# EAGLE design newbrd2 (EAGLE 7.6.0)
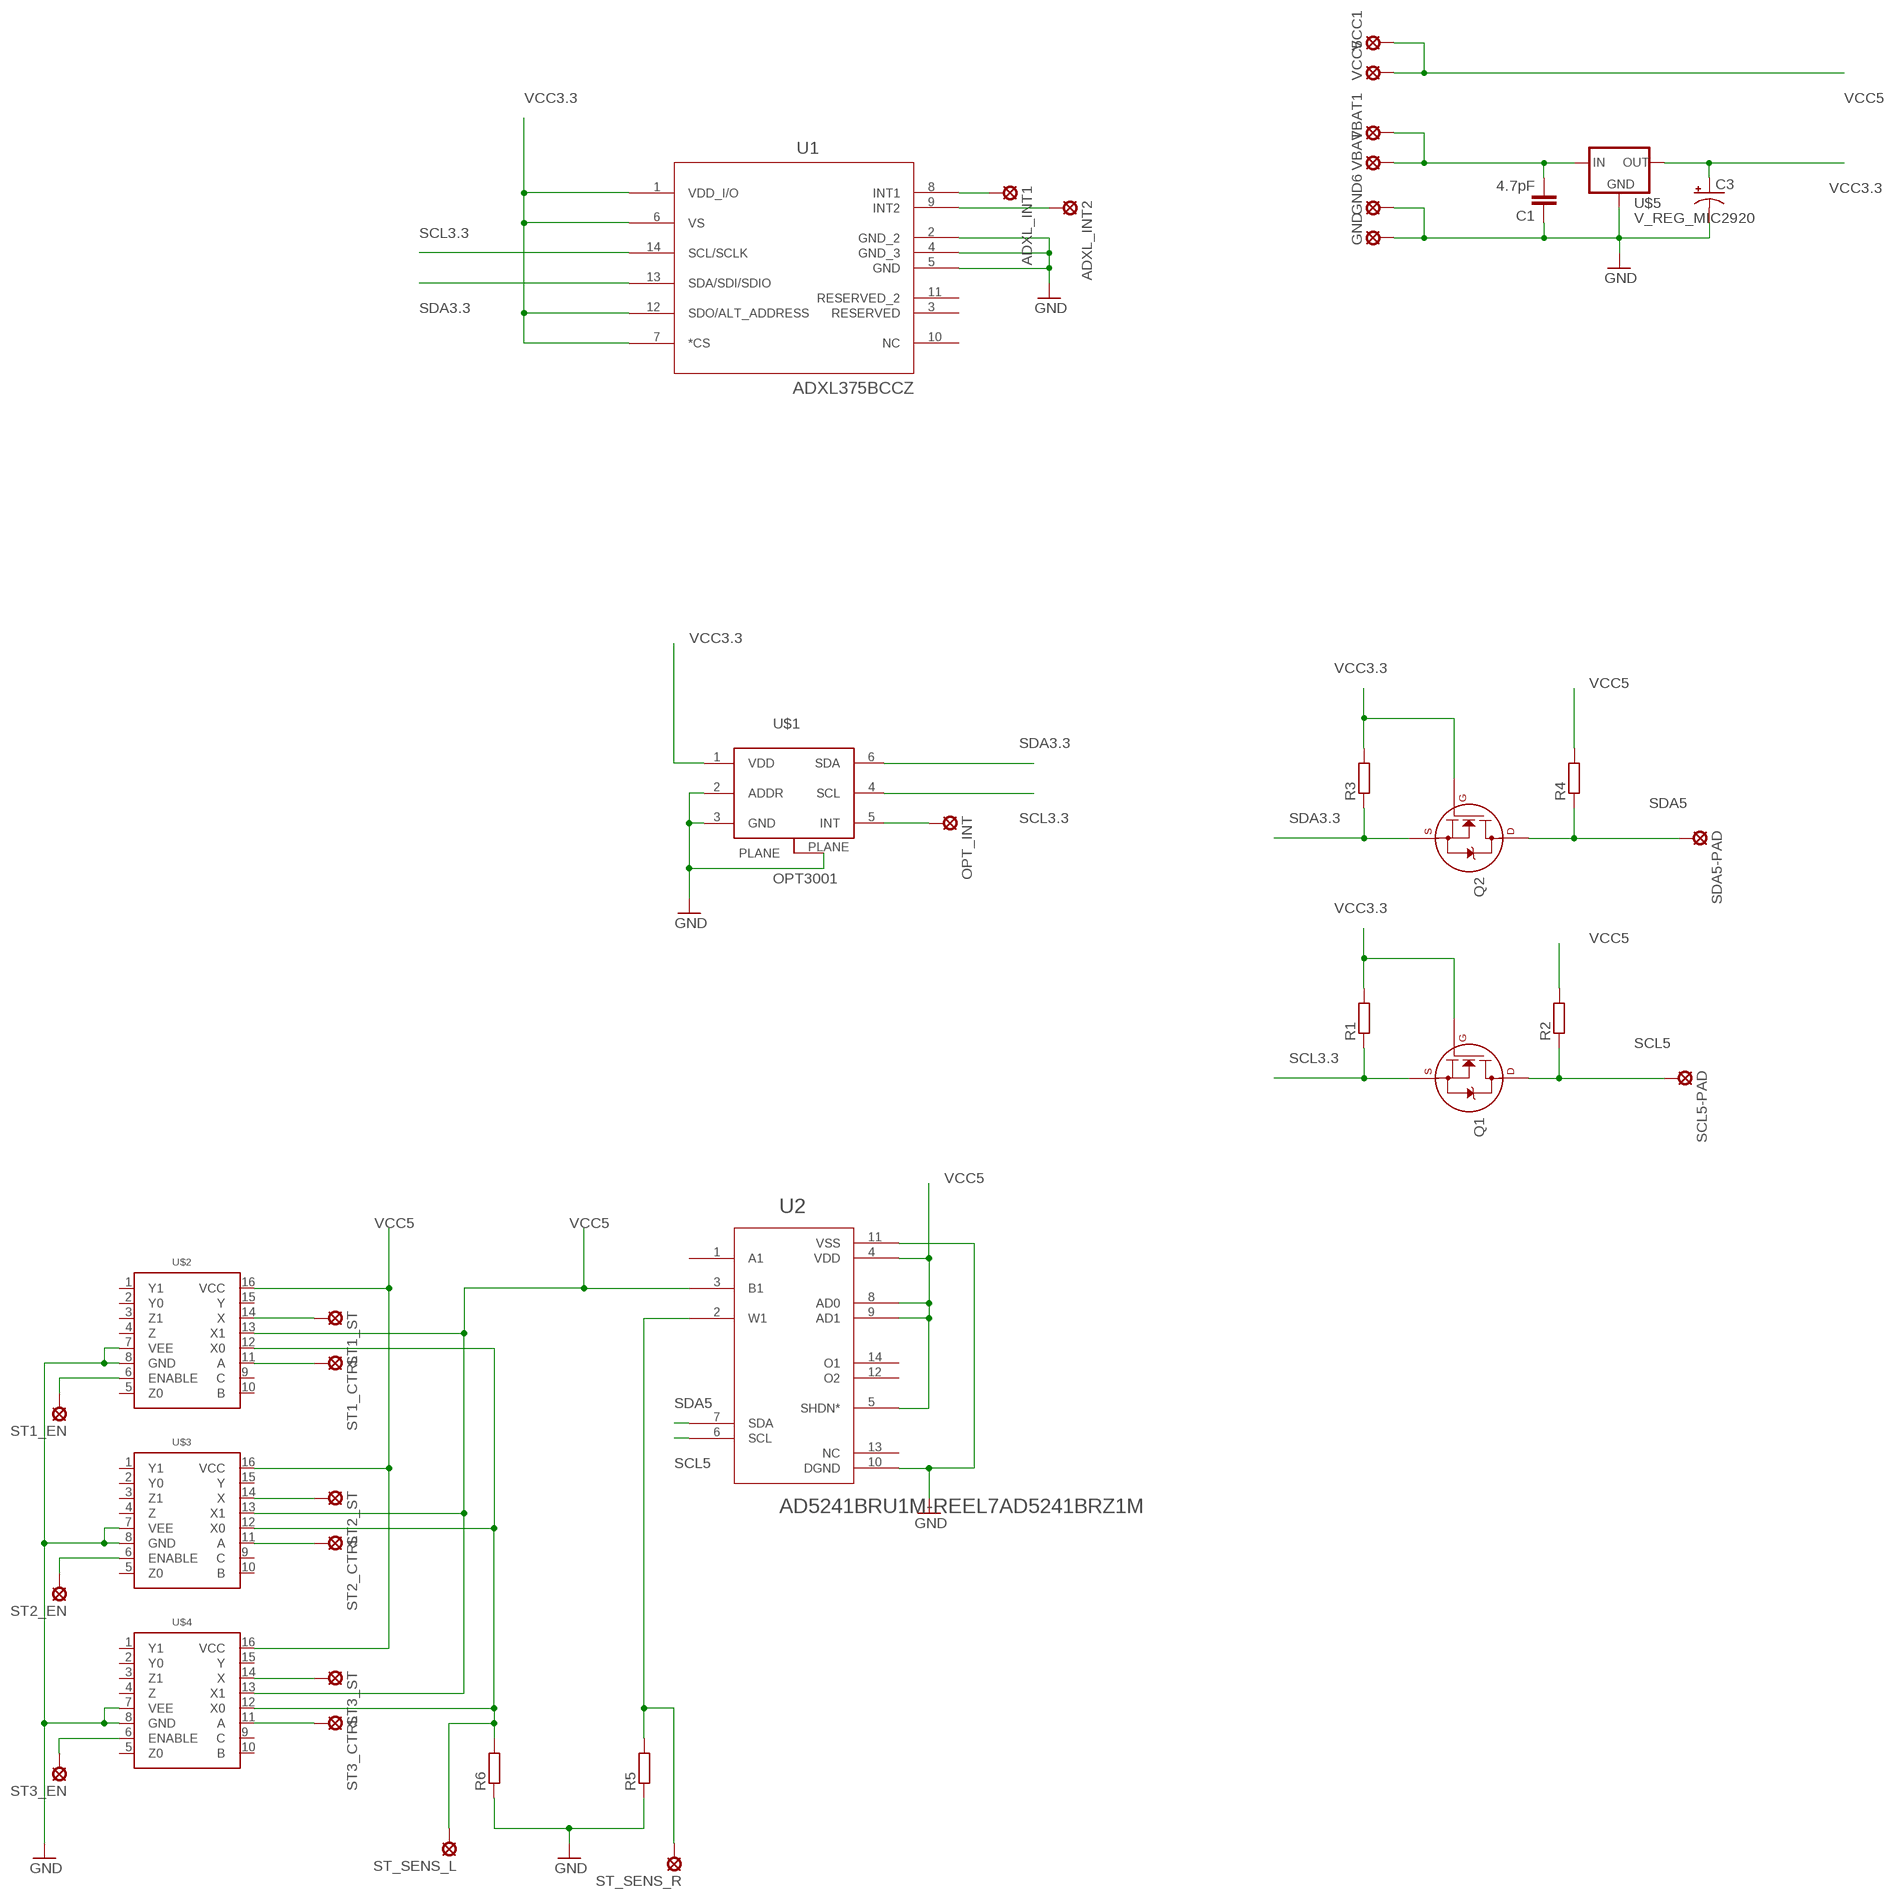
[diagram p0: schematic, sheet 1]

## Parts
ADXL_INT1  LSP10  [LSP10]
ADXL_INT2  LSP10  [LSP10]
C1  4.7pF  C-EUC0603  [C0603]
C3  CAP_POL3528  [EIA3528]
GND  LSP10  [LSP10]
GND6  LSP10  [LSP10]
OPT_INT  LSP10  [LSP10]
Q1  2N7002_SOT23  [SOT-23]
Q2  2N7002_SOT23  [SOT-23]
R1  R-EU_R0805  [R0805]
R2  R-EU_R0805  [R0805]
R3  R-EU_R0805  [R0805]
R4  R-EU_R0805  [R0805]
R5  R-EU_R0805  [R0805]
R6  R-EU_R0805  [R0805]
SCL5-PAD  LSP10  [LSP10]
SDA5-PAD  LSP10  [LSP10]
ST1_CTRL  LSP10  [LSP10]
ST1_EN  LSP10  [LSP10]
ST1_ST  LSP10  [LSP10]
ST2_CTRL  LSP10  [LSP10]
ST2_EN  LSP10  [LSP10]
ST2_ST  LSP10  [LSP10]
ST3_CTRL  LSP10  [LSP10]
ST3_EN  LSP10  [LSP10]
ST3_ST  LSP10  [LSP10]
ST_SENS_L  LSP10  [LSP10]
ST_SENS_R  LSP10  [LSP10]
U1  ADXL375BCCZ  [LGA_CC-14-1]
U2  AD5241BRU1M-REEL7AD5241BRZ1M  [SOIC-14]
U$1  OPT3001  [OPT3001]
U$2  MC74HC4051AMC74HC4051AG  [SOIC-16]
U$3  MC74HC4051AMC74HC4051AG  [SOIC-16]
U$4  MC74HC4051AMC74HC4051AG  [SOIC-16]
U$5  V_REG_MIC2920  [SOT223]
VBAT  LSP10  [LSP10]
VBAT1  LSP10  [LSP10]
VCC1  LSP10  [LSP10]
VCC5  LSP10  [LSP10]

## Nets
GND: C1.1 C3.C(-) GND6.MP GND.MP R5.1 R6.1 U1.2(GND_2) U1.4(GND_3) U1.5(GND) U2.10(DGND) U2.11(VSS) U$1.2(ADDR) U$1.3(GND) U$1.PLANE U$2.7(VEE) U$2.8(GND) U$3.7(VEE) U$3.8(GND) U$4.7(VEE) U$4.8(GND) U$5.2(GND)
N$1: C1.2 U$5.1(IN) VBAT1.MP VBAT.MP
N$2: ST1_ST.MP U$2.14(X)
N$3: ST1_EN.MP U$2.6(ENABLE)
N$4: ST3_EN.MP U$4.6(ENABLE)
N$5: ST2_ST.MP U$3.14(X)
N$6: ST3_ST.MP U$4.14(X)
N$8: R5.2 ST_SENS_R.MP U2.2(W1)
N$9: R6.2 ST_SENS_L.MP U$2.12(X0) U$3.12(X0) U$4.12(X0)
N$11: ST2_EN.MP U$3.6(ENABLE)
N$12: ST2_CTRL.MP U$3.11(A)
N$13: ST3_CTRL.MP U$4.11(A)
N$14: ST1_CTRL.MP U$2.11(A)
N$15: OPT_INT.MP U$1.5(INT)
N$16: ADXL_INT1.MP U1.8(INT1)
N$17: ADXL_INT2.MP U1.9(INT2)
SCL3.3: Q1.2(S) R1.1 U1.14(SCL/SCLK) U$1.4(SCL)
SCL5: Q1.3(D) R2.1 SCL5-PAD.MP U2.6(SCL)
SDA3.3: Q2.2(S) R3.1 U1.13(SDA/SDI/SDIO) U$1.6(SDA)
SDA5: Q2.3(D) R4.1 SDA5-PAD.MP U2.7(SDA)
VCC3.3: C3.A(+) Q1.1(G) Q2.1(G) R1.2 R3.2 U1.1(VDD_I/O) U1.6(VS) U1.7(*CS) U1.12(SDO/ALT_ADDRESS) U$1.1(VDD) U$5.3(OUT)
VCC5: R2.2 R4.2 U2.3(B1) U2.4(VDD) U2.5(SHDN*) U2.8(AD0) U2.9(AD1) U$2.13(X1) U$2.16(VCC) U$3.13(X1) U$3.16(VCC) U$4.13(X1) U$4.16(VCC) VCC1.MP VCC5.MP
Unconnected: U1.3(RESERVED) U1.10(NC) U1.11(RESERVED_2) U2.1(A1) U2.12(O2) U2.13(NC) U2.14(O1) U$2.1(Y1) U$2.2(Y0) U$2.3(Z1) U$2.4(Z) U$2.5(Z0) U$2.9(C) U$2.10(B) U$2.15(Y) U$3.1(Y1) U$3.2(Y0) U$3.3(Z1) U$3.4(Z) U$3.5(Z0) U$3.9(C) U$3.10(B) U$3.15(Y) U$4.1(Y1) U$4.2(Y0) U$4.3(Z1) U$4.4(Z) U$4.5(Z0) U$4.9(C) U$4.10(B) U$4.15(Y)

## Library data of the parts
ADXL_INT1 ADXL_INT2 GND GND6 OPT_INT SCL5-PAD SDA5-PAD ST1_CTRL ST1_EN ST1_ST ST2_CTRL ST2_EN ST2_ST ST3_CTRL ST3_EN ST3_ST ST_SENS_L ST_SENS_R VBAT VBAT1 VCC1 VCC5 = solpad:LSP10: SOLDER PAD drill 1.0 mm, distributor Buerklin, 12H555
C1 = rcl:C-EU: CAPACITOR, European symbol
C3 = SparkFun-Capacitors:CAP_POL: Capacitor Polarized These are standard SMD and PTH capacitors. Normally 10uF, 47uF, and 100uF in electrolytic and tantalum varieties. Always verify the external diameter of the through hole cap, it varies with capacity, voltage, and manufacturer. The EIA devices should be standard.
Q1 Q2 = transistors:2N700*: 2N7000, 2N7002, NDS7002A N-channel enhancement mode MOSFET
R1-R6 = resistor:R-EU_: RESISTOR, European symbol
U1 = elements:ADXL375BCCZ
U2 = elements:AD5241BRU1M-REEL7
U$1 = datchiki:OPT3001
U$2-U$4 = elements:MC74HC4051A
U$5 = SparkFun-PowerIC:V_REG_MIC2920: MIC2920A (http://www.micrel.com/_PDF/mic2920.pdf) - 400mA output LDO Regulator

## Board
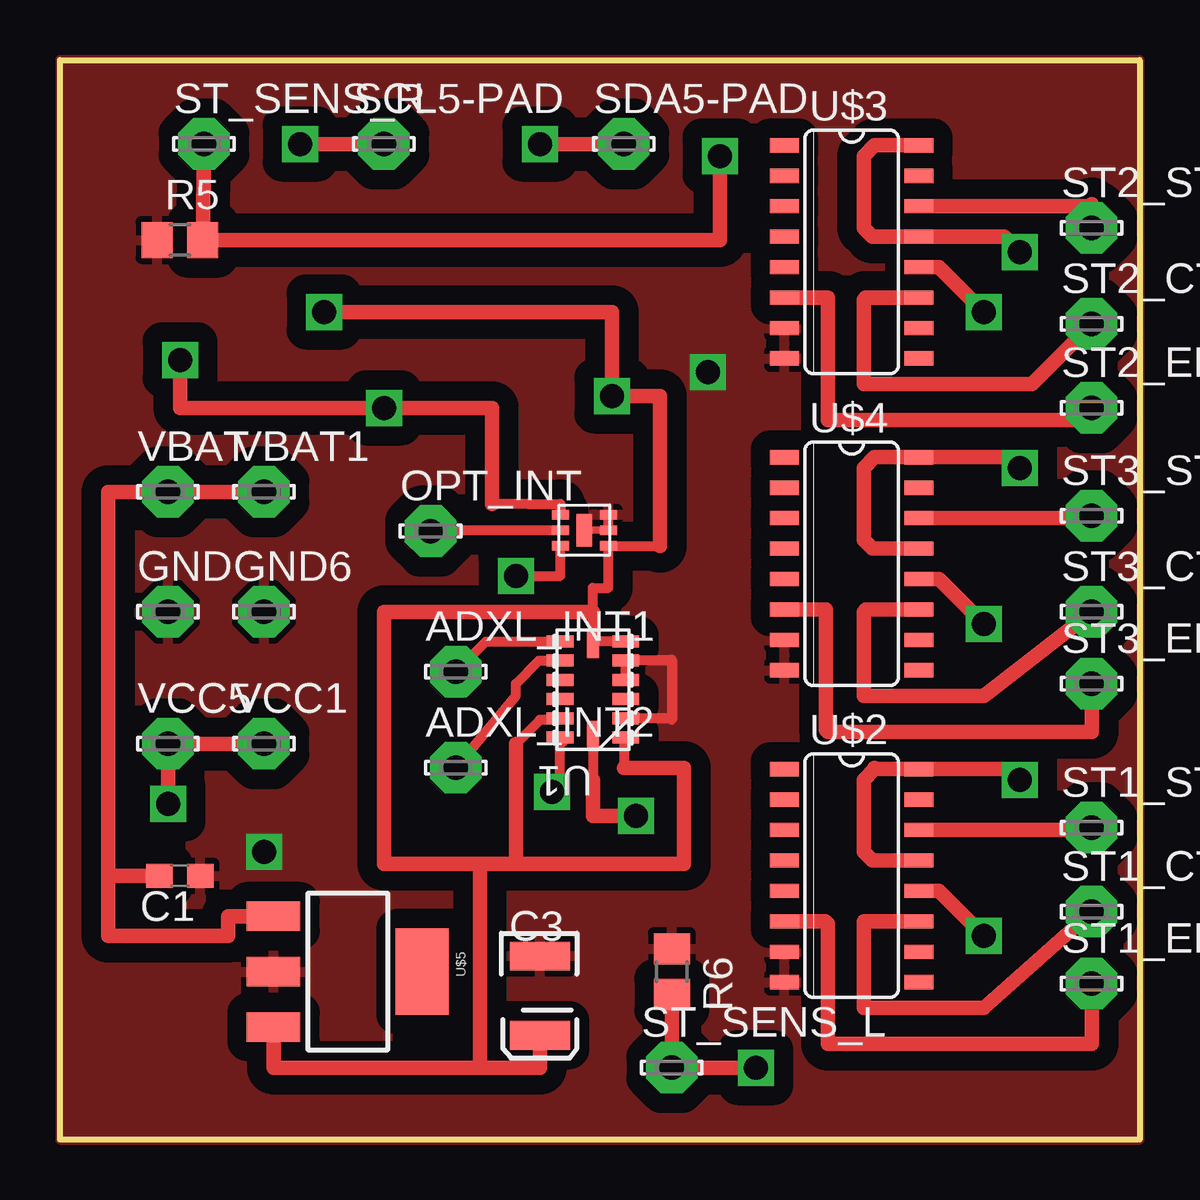
[diagram p1: board, top side]
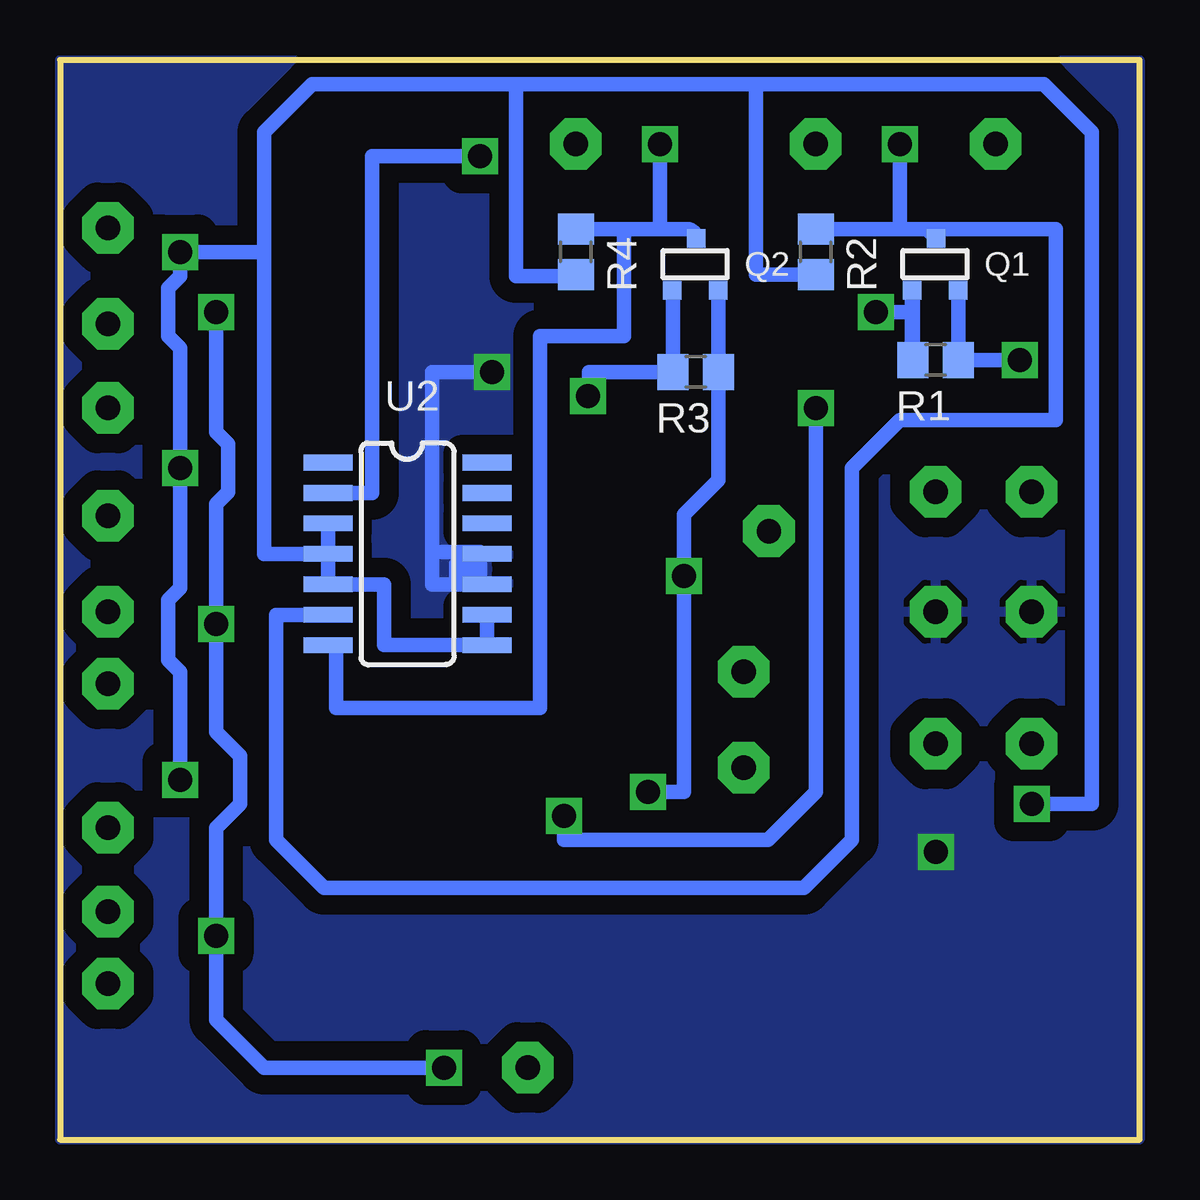
[diagram p2: board, bottom side, seen from below]

Size 45 x 45 mm. Coordinates in mm from the lower left corner, seen from the top.
Outline: 0,0 0,45 45,45 45,0 0,0
Copper layers (1*16): Top 0.035mm / dielectric 1.5mm / Bottom 0.035mm
Design rules "default *": minimum track width 10mil, minimum drill 1mm, track to track 8mil, track to pad 8mil, pad to pad 8mil, via to via 8mil, smd to smd 8mil, copper to edge 0mil, drill to drill 8mil, minimum pad ring 10mil, minimum via ring 8mil, stop-mask expansion 4mil, vias tented up to drill 0mil, thermal gap 10mil

### Footprints (pad centres in the part's own frame; a part is rotated, then mirrored left to right if it is on the bottom)
LSP10 = drill 1.016 pad 2.159 octagon: MP 0,0
C0603 = smd 1.1 x 1: 1 -0.85,0; 2 0.85,0
EIA3528 = smd 1.2 x 2.5: A 1.65,0; C -1.65,0
SOT-23 = smd 0.762 x 0.762: 1 -0.979,-1.101; 2 0.94,-1.101; 3 0.025,1.067
R0805 = smd 1.3 x 1.5: 1 -0.95,0; 2 0.95,0
LGA_CC-14-1 = smd 1.118 x 0.5: 1 -1.371,2; 2 -1.371,1.2; 3 -1.371,0.4; 4 -1.371,-0.4; 5 -1.371,-1.2; 6 -1.371,-2; 8 1.371,-2; 9 1.371,-1.2; 10 1.371,-0.4; 11 1.371,0.4; 12 1.371,1.2; 13 1.371,2 | smd 0.5 x 1.118: 7 0,-1.871; 14 0,1.871
SOIC-14 = smd 0.66 x 2.032: 1 -4.445,-3.315; 2 -3.175,-3.315; 3 -1.905,-3.315; 4 -0.635,-3.315; 5 0.635,-3.315; 6 1.905,-3.315; 7 3.175,-3.315; 8 3.175,3.315; 9 1.905,3.315; 10 0.635,3.315; 11 -0.635,3.315; 12 -1.905,3.315; 13 -3.175,3.315; 14 -4.445,3.315
OPT3001 = smd 0.7 x 0.4: 1 -1,0.65; 2 -1,0; 3 -1,-0.65; 4 1,-0.65; 5 1,0; 6 1,0.65 | smd 0.65 x 1.35: PLANE 0,0
SOIC-16 = smd 0.6 x 1.2: 1 -4.445,-2.8; 2 -3.175,-2.8; 3 -1.905,-2.8; 4 -0.635,-2.8; 5 0.635,-2.8; 6 1.905,-2.8; 7 3.175,-2.8; 8 4.445,-2.8; 9 4.445,2.8; 10 3.175,2.8; 11 1.905,2.8; 12 0.635,2.8; 13 -0.635,2.8; 14 -1.905,2.8; 15 -3.175,2.8; 16 -4.445,2.8
SOT223 = smd 1.219 x 2.235: 1 -2.311,-3.099; 2 0,-3.099; 3 2.311,-3.099 | smd 3.6 x 2.2: 4 0,3.099

### Placement (x,y rotation side)
ADXL_INT1  16.5,19.5 0 top
ADXL_INT2  16.5,15.5 0 top
C1  5,11 180 top
C3  20,6 270 top
GND  4.5,22 0 top
GND6  8.5,22 0 top
OPT_INT  15.45,25.36 0 top
Q1  8.5,36.5 0 bottom
Q2  18.5,36.5 0 bottom
R1  8.5,32.5 180 bottom
R2  13.5,37 270 bottom
R3  18.5,32 180 bottom
R4  23.5,37 270 bottom
R5  5,37.5 0 top
R6  25.5,7 270 top
SCL5-PAD  13.5,41.5 0 top
SDA5-PAD  23.5,41.5 0 top
ST1_CTRL  43,9.5 0 top
ST1_EN  43,6.5 0 top
ST1_ST  43,13 0 top
ST2_CTRL  43,34 0 top
ST2_EN  43,30.5 0 top
ST2_ST  43,38 0 top
ST3_CTRL  43,22 0 top
ST3_EN  43,19 0 top
ST3_ST  43,26 0 top
ST_SENS_L  25.5,3 0 top
ST_SENS_R  6,41.5 0 top
U1  22.21,18.76 180 top
U2  30.51,23.78 270 bottom
U$1  21.86,25.4 180 top
U$2  33,11 270 top
U$3  33,37 270 top
U$4  33,24 270 top
U$5  12,7 270 top
VBAT  4.5,27 0 top
VBAT1  8.5,27 0 top
VCC1  8.5,16.5 0 top
VCC5  4.5,16.5 0 top

### Tracks (layer width: path | path; a pad name or v marks a point on that pad's centre or on a via)
GND  (via drill 1)
  Top 0.305: U$1.PLANE U$1.2
  Top 0.406: U1.4 U1.5 23.62,20 25.5,20 25.5,17.5 25.44,17.56 U1.2 | U$1.2 U$1.3
  Bottom 0.61: 29.5,24.5 29.5,23.14 U2.10 27.5,23.14 27.5,23.5 | 29.5,24.5 29.5,32 v27,32 | 27.5,24.5 29.5,24.5 | 27.5,23.5 27.5,24 28.5,24 28.5,23.5 27.5,23.5
  other vias: 8.5,12
  pour Bottom (isolate 0.813): 0,0 45,0 45,45 0,45
  pour Top (isolate 0.813): 0,0 45,0 45,45 0,45
N$1
  Top 0.61: 2,11 2,27 VBAT.MP VBAT1.MP | 2,11 2,8.5 7,8.5 7,9.31 U$5.1 | C1.2 2,11
N$2
  Top 0.61: 43,12.98 ST1_ST.MP 42.91,12.9 U$2.14
N$3
  Top 0.61: ST1_EN.MP 43,4 32,4 32,9 31.91,9.1 U$2.6
N$4
  Top 0.61: ST3_EN.MP 43,17 32,17 31.93,17.07 31.93,22.09 U$4.6
N$5
  Top 0.61: ST2_ST.MP 43,38.98 42.92,38.91 U$3.14
N$6
  Top 0.61: 43,25.98 ST3_ST.MP arc-90 42.91,25.91 U$4.14
N$8  (via drill 1)
  Top 0.61: ST_SENS_R.MP R5.2 27.5,37.5 v27.5,41
  Bottom 0.61: U2.2 32,26.95 32,41 v27.5,41
N$9  (via drill 1)
  Top 0.61: v29,3 ST_SENS_L.MP R6.2 | v38.5,34.5 36.63,36.37 U$3.12 | U$4.12 36.63,23.36 v38.5,21.5 | U$2.12 36.63,10.37 v38.5,8.5
  Bottom 0.61: v29,3 36.5,3 38.5,5 v38.5,8.5 38.5,13 37.5,14 37.5,16 38.5,17 v38.5,21.5 38.5,26.5 38,27 38,29 38.5,29.5 v38.5,34.5
N$11
  Top 0.61: ST2_EN.MP 42.5,30 32,30 32,35.09 U$3.6
N$12
  Top 0.61: ST2_CTRL.MP 40.5,31.5 33.5,31.5 33.5,35.02 33.58,35.09 U$3.11
N$13
  Top 0.61: ST3_CTRL.MP 38.5,18.5 33.5,18.5 33.5,22 33.59,22.09 U$4.11
N$14
  Top 0.61: ST1_CTRL.MP 38.5,5.5 33.5,5.5 33.5,9.1 U$2.11
N$15
  Top 0.305: 20.86,25.36 U$1.5
  Top 0.406: OPT_INT.MP 15.49,25.4 U$1.5
N$16
  Top 0.406: ADXL_INT1.MP 17.76,20.76 U1.8
N$17
  Top 0.406: ADXL_INT2.MP 19,18.5 19,19 19.96,19.96 U1.9
SCL3.3  (via drill 1)
  Top 0.406: 18,26.5 19.5,26.5 20.86,26.5 U$1.4 | U1.14 22.21,15 22.21,14.79
  Top 0.61: v5,32.5 5,30.5 v13.5,30.5 18,30.5 18,26.5 | v24,13.5 22.21,13.5 22.21,15
  Bottom 0.61: Q1.2 arc90 7.55,35.39 R1.1 v5,32.5 | v13.5,30.5 13.5,14.5 15.5,12.5 24,12.5 v24,13.5
SCL5  (via drill 1)
  Top 0.61: v10,41.5 SCL5-PAD.MP
  Bottom 0.61: Q1.3 8.86,37.95 | 8.86,37.95 6.5,37.95 | 8.86,37.95 R2.1 | U2.6 36,21.88 36,12.5 34,10.5 14,10.5 12,12.5 12,28 10,30 3.5,30 3.5,37.95 R2.1 | R2.1 10,37.95 v10,41.5
SDA3.3  (via drill 1)
  Top 0.406: 21,16.6 U1.13 20.84,14.84 v20.5,14.5 | v19,23.5 20.86,23.5 U$1.6
  Bottom 0.406: v19,23.5 19.05,23.5 | R3.1 17.5,31.95
  Bottom 0.61: Q2.2 arc90 17.55,35.39 R3.1 17.55,27.5 19,26.05 v19,23.5 19,14.5 v20.5,14.5
SDA5  (via drill 1)
  Top 0.61: v20,41.5 SDA5-PAD.MP
  Bottom 0.61: 21.5,37.95 R4.1 20,37.95 v20,41.5 | 21.5,37.95 18.86,37.95 arc90 Q2.3 | U2.7 33.5,20.61 33.5,18 25,18 25,33.5 21.5,33.5 21.5,37.95
VCC3.3  (via drill 1)
  Top 0.305: 20.84,17.5 U1.12
  Top 0.406: 25,24.75 U$1.1 22.86,23 22.21,23 22.21,22 22.21,20.76 | U1.1 23.5,16.76 23.5,15.5 | U1.6 22.21,20.76 | 22.21,20.76 U1.7 | 20.84,17.5 20,17.5 19,16.5
  Top 0.61: 25,24.75 25,31 v23,31 23,34.5 v11,34.5 | 19,11.5 26,11.5 26,15.5 23.5,15.5 | 17.5,11.5 13.5,11.5 13.5,22 22.21,22 | 19,16.5 19,11.5 | C3.A 20,3 17.5,3 | U$5.3 8.9,3 17.5,3 | 19,11.5 17.5,11.5 | 17.5,11.5 17.5,3
  Bottom 0.61: R1.2 9.45,35.37 arc-90 Q1.1 9.48,34.5 | Q2.1 arc90 19.45,35.37 R3.2 22.95,32 v23,31 | 9.48,34.5 9.48,32.52 9.5,32.5 | v11,34.5 9.48,34.5
VCC5  (via drill 1)
  Top 0.61: VCC1.MP VCC5.MP v4.5,14 | v40,37 39.37,37.63 U$3.13 33.87,37.63 33.5,38 33.5,41 33.95,41.45 U$3.16 | U$4.13 33.87,24.64 33.5,25 33.5,28 33.95,28.45 U$4.16 39.55,28.45 v40,28 | U$2.13 33.87,11.63 33.5,12 33.5,15 33.95,15.45 | 33.95,15.45 U$2.16 39.55,15.45 v40,15 | 33.95,15.45 33.95,15.5
  Bottom 0.61: U2.4 U2.5 | U2.5 32.65,23.14 | U2.9 U2.8 31.5,20.61 31.5,23.14 U2.5 | U2.4 36.5,24.41 36.5,37 | 36.5,37 v40,37 40,36 40.5,35.5 40.5,33.5 40,33 v40,28 40,23 40.5,22.5 40.5,20 40,19.5 v40,15 | R2.2 16,36.05 16,44 | 16,44 26,44 | 26,44 34.5,44 36.5,42 36.5,37 | R4.2 23.5,36 26,36 26,44 | 16,44 4,44 2,42 2,14 v4.5,14 | U2.3 U2.4